# Altium project PCB-IO-PROTECTION-INDUCTANCE-2.PrjPcb
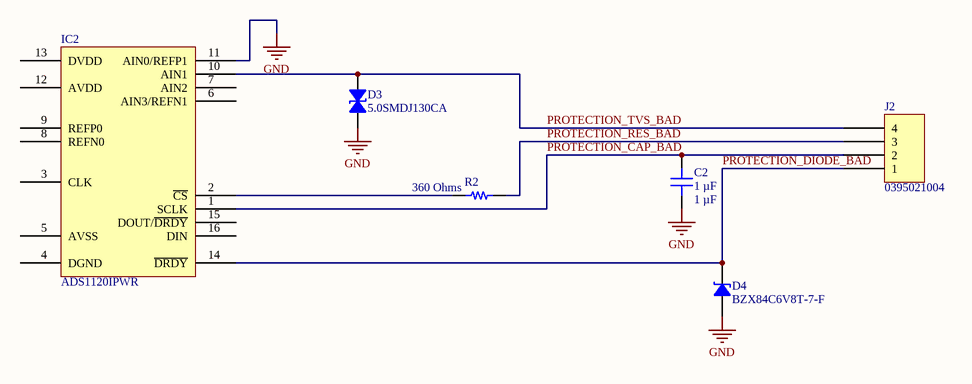
[diagram p0: PCB-IO-PROTECTION-INDUCTANCE-2.SchDoc]
1 sheet, 6 parts. Net scope: global (net labels, ports and power ports of the same name join across sheets).
Board file: PCB-IO-PROTECTION-INDUCTANCE-2.PcbDoc

## Sheet PCB-IO-PROTECTION-INDUCTANCE-2.SchDoc
size A3; SheetNumber: 1; SheetTotal: 1

### Parts
C2  1 µF  [CAP 0603_1608]
D3  5.0SMDJ130CA  [DO214AB SMC]
D4  BZX84C6V8T-7-F  [DIODES SOT-523]
IC2  ADS1120IPWR  [TI TSSOP-16 PW]
J2  0395021004  [MOLEX 395021004]
R2  360 Ohms  [RES 0603_1608]

### Nets
GND: C2.1 D3.1 D4.1 IC2.11(AIN0/REFP1)
PROTECTION_CAP_BAD: C2.2 IC2.1(SCLK) J2.2
PROTECTION_DIODE_BAD: D4.2 IC2.14(~{DRDY}) J2.1
PROTECTION_RES_BAD: J2.3 R2.2
PROTECTION_TVS_BAD: D3.2 IC2.10(AIN1) J2.4
NetIC2_2: IC2.2(~{CS}) R2.1

Not connected (* = marked no-connect by the designer): IC2 3(CLK) 4(DGND) 5(AVSS) 6(AIN3/REFN1) 7(AIN2) 8(REFN0) 9(REFP0) 12(AVDD) 13(DVDD) 15(DOUT/~{DRDY}) 16(DIN)

### Notes on the sheet
- TITLE:
- AUTHOR :
- DOCUMENT NAME:
- PART NO.:
- TEMPLATE:
- A3
- REVIEWER:
- This document is created by Mitai. Any further questions can be asked through
- Sheet
- of
- DATE:
- team@mitai.ai.
- Contact Address:Rosenheimer Straße 116b,81669, München.

### Library data of the parts
C2 = C0603C105K4RACAUTO: CAP CER 1UF 16V X7R 0603; Part Number: C0603C105K4RACAUTO; Value: 1 µF
D3 = 5.0SMDJ130CA: TVS DIODE 130VWM 209VC DO214AB; Part Number: 5.0SMDJ130CA
D4 = BZX84C6V8T-7-F: DIODE ZENER 6.8V 150MW SOT523; Part Number: BZX84C6V8T-7-F
IC2 = ADS1120IPWR: IC ADC 16BIT SIGMA-DELTA 16TSSOP; Part Number: ADS1120IPWR
J2 = 0395021004: TERM BLOCK HDR 4POS 90DEG 3.5MM; Manufacturer: Molex; Current - UL: 8A; Header Orientation: 90°, Right Angle; Number of Levels: 1; Number of Positions: 4; Pitch: 0.138" (3.50mm); Voltage - UL: 300V; Part Number: 0395021004; Color: Black; ComponentLink1Description: Datasheet; ComponentLink1URL: https://www.molex.com/pdm_docs/sd/395021002_sd.pdf; ComponentLink2Description: DigiKey Link; ComponentLink2URL: http://digikey.com/product-detail/en/molex/0395021004/WM7772-ND/1280623; Contact Mating Finish: Tin; LastUpdated: 25/06/2020 15:44:36; Lifecycle Status: Active; Minimum Order: 1; Mounting Type: Through Hole; Operating Temperature: -40°C ~ 105°C; Packaging: Tray; Part Status: Active; Positions Per Level: 4; Price: 1.07; Series: Eurostyle ESE 39502; Supplier 1: DigiKey; Supplier Part Number 1: WM7772-ND; Termination Style: Solder; Type: Header, Male Pins, Shrouded (4 Side)
R2 = ERJ-PB3B3600V: RES SMD 360 OHM 0.1% 1/5W 0603; Part Number: ERJ-PB3B3600V; Value: 360 Ohms